# Altium schematic sheet ControlBox.SchDoc: Demonstration System Control Box
size A4; DrawnBy: J.F.B; Revision: 3; SheetNumber: 1; SheetTotal: 1
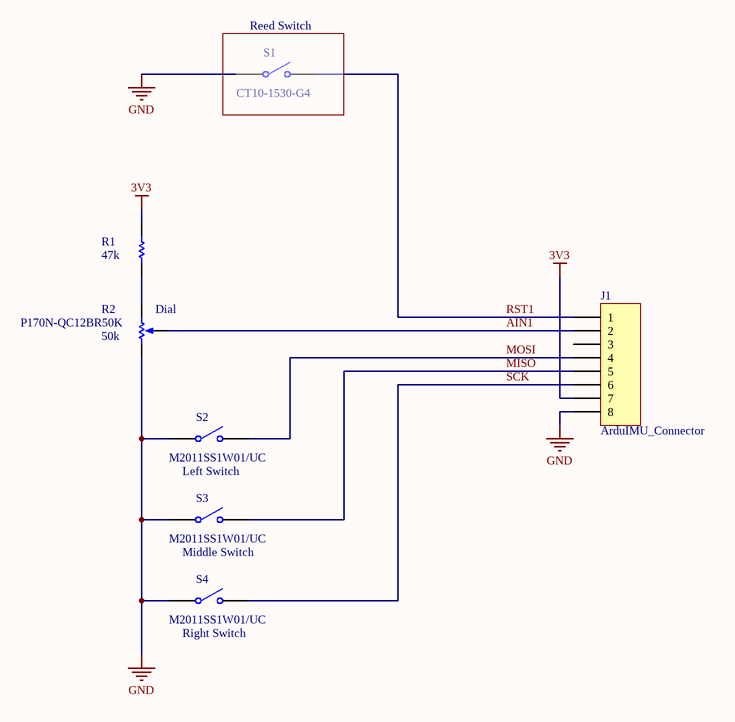
[diagram p0: ControlBox.SchDoc]

## Parts
J1  ArduIMU_Connector  [HDR1X8]
R1  value 47k  [AXIAL-0.3]
R2  P170N-QC12BR50K  value 50k  [VR5]
S1  CT10-1530-G4  [SPST-2]
S2  M2011SS1W01/UC  [SPST-2]
S3  M2011SS1W01/UC  [SPST-2]
S4  M2011SS1W01/UC  [SPST-2]

## Blocks framed on the sheet
Reed Switch: S1

## Nets
3V3: J1.7 R1.2
GND: J1.8 R2.1(TOP) S1.1(COMMON) S2.1(COMMON) S3.1(COMMON) S4.1(COMMON)
AIN1: J1.2 R2.3(TAP)
MISO: J1.5 S3.2(NO)
MOSI: J1.4 S2.2(NO)
RST1: J1.1 S1.2(NO)
SCK: J1.6 S4.2(NO)
NetR1_1: R1.1 R2.2(BOT)

Not connected (* = marked no-connect by the designer): J1 3

## Notes on the sheet
- (near R2) Dial
- Left Switch
- Middle Switch
- (near S4) Right Switch

## Library data of the parts
J1 = Header 8: Header, 8-Pin; LatestRevisionDate: 17-Jul-2002; LatestRevisionNote: Re-released for DXP Platform.; Publisher: Altium Limited
R1 = Res1: Resistor; Published: 8-Jun-2000; LatestRevisionDate: 17-Jul-2002; LatestRevisionNote: Re-released for DXP Platform.; PackageReference: AXIAL-0.3; Publisher: Altium Limited; PackageDescription: Axial Device, Thru-Hole; 2 Leads; 0.3 in Pin Spacing
R2 = RPot: Potentiometer; Sim Note: Enter the Resistance value and the set point into parameter fields.; Set Position: 0.5; Published: 8-Jun-2000; LatestRevisionDate: 17-Jul-2002; LatestRevisionNote: Re-released for DXP Platform.; PackageReference: VR5; Publisher: Altium Limited; PackageDescription: Variable Resistor, Thru-Hole; 3 Leads
S1-S4 = SW-SPST: Single-Pole, Single-Throw Switch; Published: 24-Mar-1999; LatestRevisionDate: 17-Jul-2002; LatestRevisionNote: Re-released for DXP Platform.; PackageReference: SPST-2; Publisher: Altium Limited; PackageDescription: Switch; 2 Leads